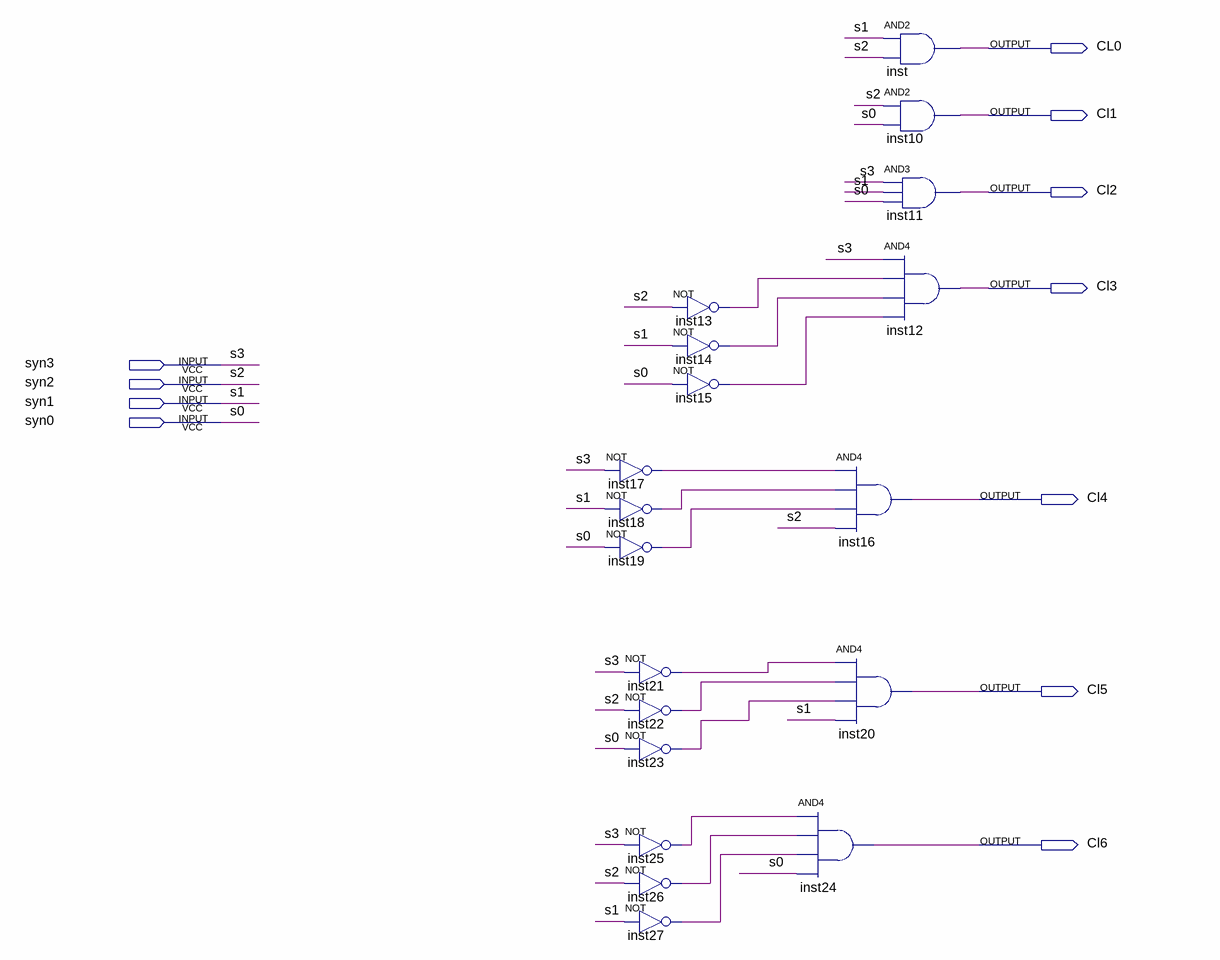
[diagram p0: schematic sheet]
// Quartus schematic correction_logic.bdf as structural Verilog: 19 symbols, 11 pins
module correction_logic (
  input  syn3,
  input  syn2,
  input  syn1,
  input  syn0,
  output CL0,
  output Cl1,
  output Cl2,
  output Cl3,
  output Cl4,
  output Cl5,
  output Cl6
);

  wire inst13_out, inst14_out, inst15_out, inst17_out, inst18_out, inst19_out, inst21_out, inst22_out,
       inst23_out, inst25_out, inst26_out, inst27_out;

  not inst13 (inst13_out, syn2);
  not inst14 (inst14_out, syn1);
  not inst15 (inst15_out, syn0);
  not inst17 (inst17_out, syn3);
  not inst18 (inst18_out, syn1);
  not inst19 (inst19_out, syn0);
  not inst21 (inst21_out, syn3);
  not inst22 (inst22_out, syn2);
  not inst23 (inst23_out, syn0);
  not inst25 (inst25_out, syn3);
  not inst26 (inst26_out, syn2);
  not inst27 (inst27_out, syn1);
  and inst24 (Cl6, inst25_out, inst26_out, inst27_out, syn0);
  and inst (CL0, syn1, syn2);
  and inst10 (Cl1, syn2, syn0);
  and inst11 (Cl2, syn3, syn1, syn0);
  and inst12 (Cl3, syn3, inst13_out, inst14_out, inst15_out);
  and inst16 (Cl4, inst17_out, inst18_out, inst19_out, syn2);
  and inst20 (Cl5, inst21_out, inst22_out, inst23_out, syn1);

  // Other names for the same wires on the sheet: s0 = syn0; s1 = syn1; s2 = syn2; s3 = syn3
endmodule
